# Altium schematic sheet CM_MODULE.SchDoc: Compute Module 4 (Part #2)
size A3
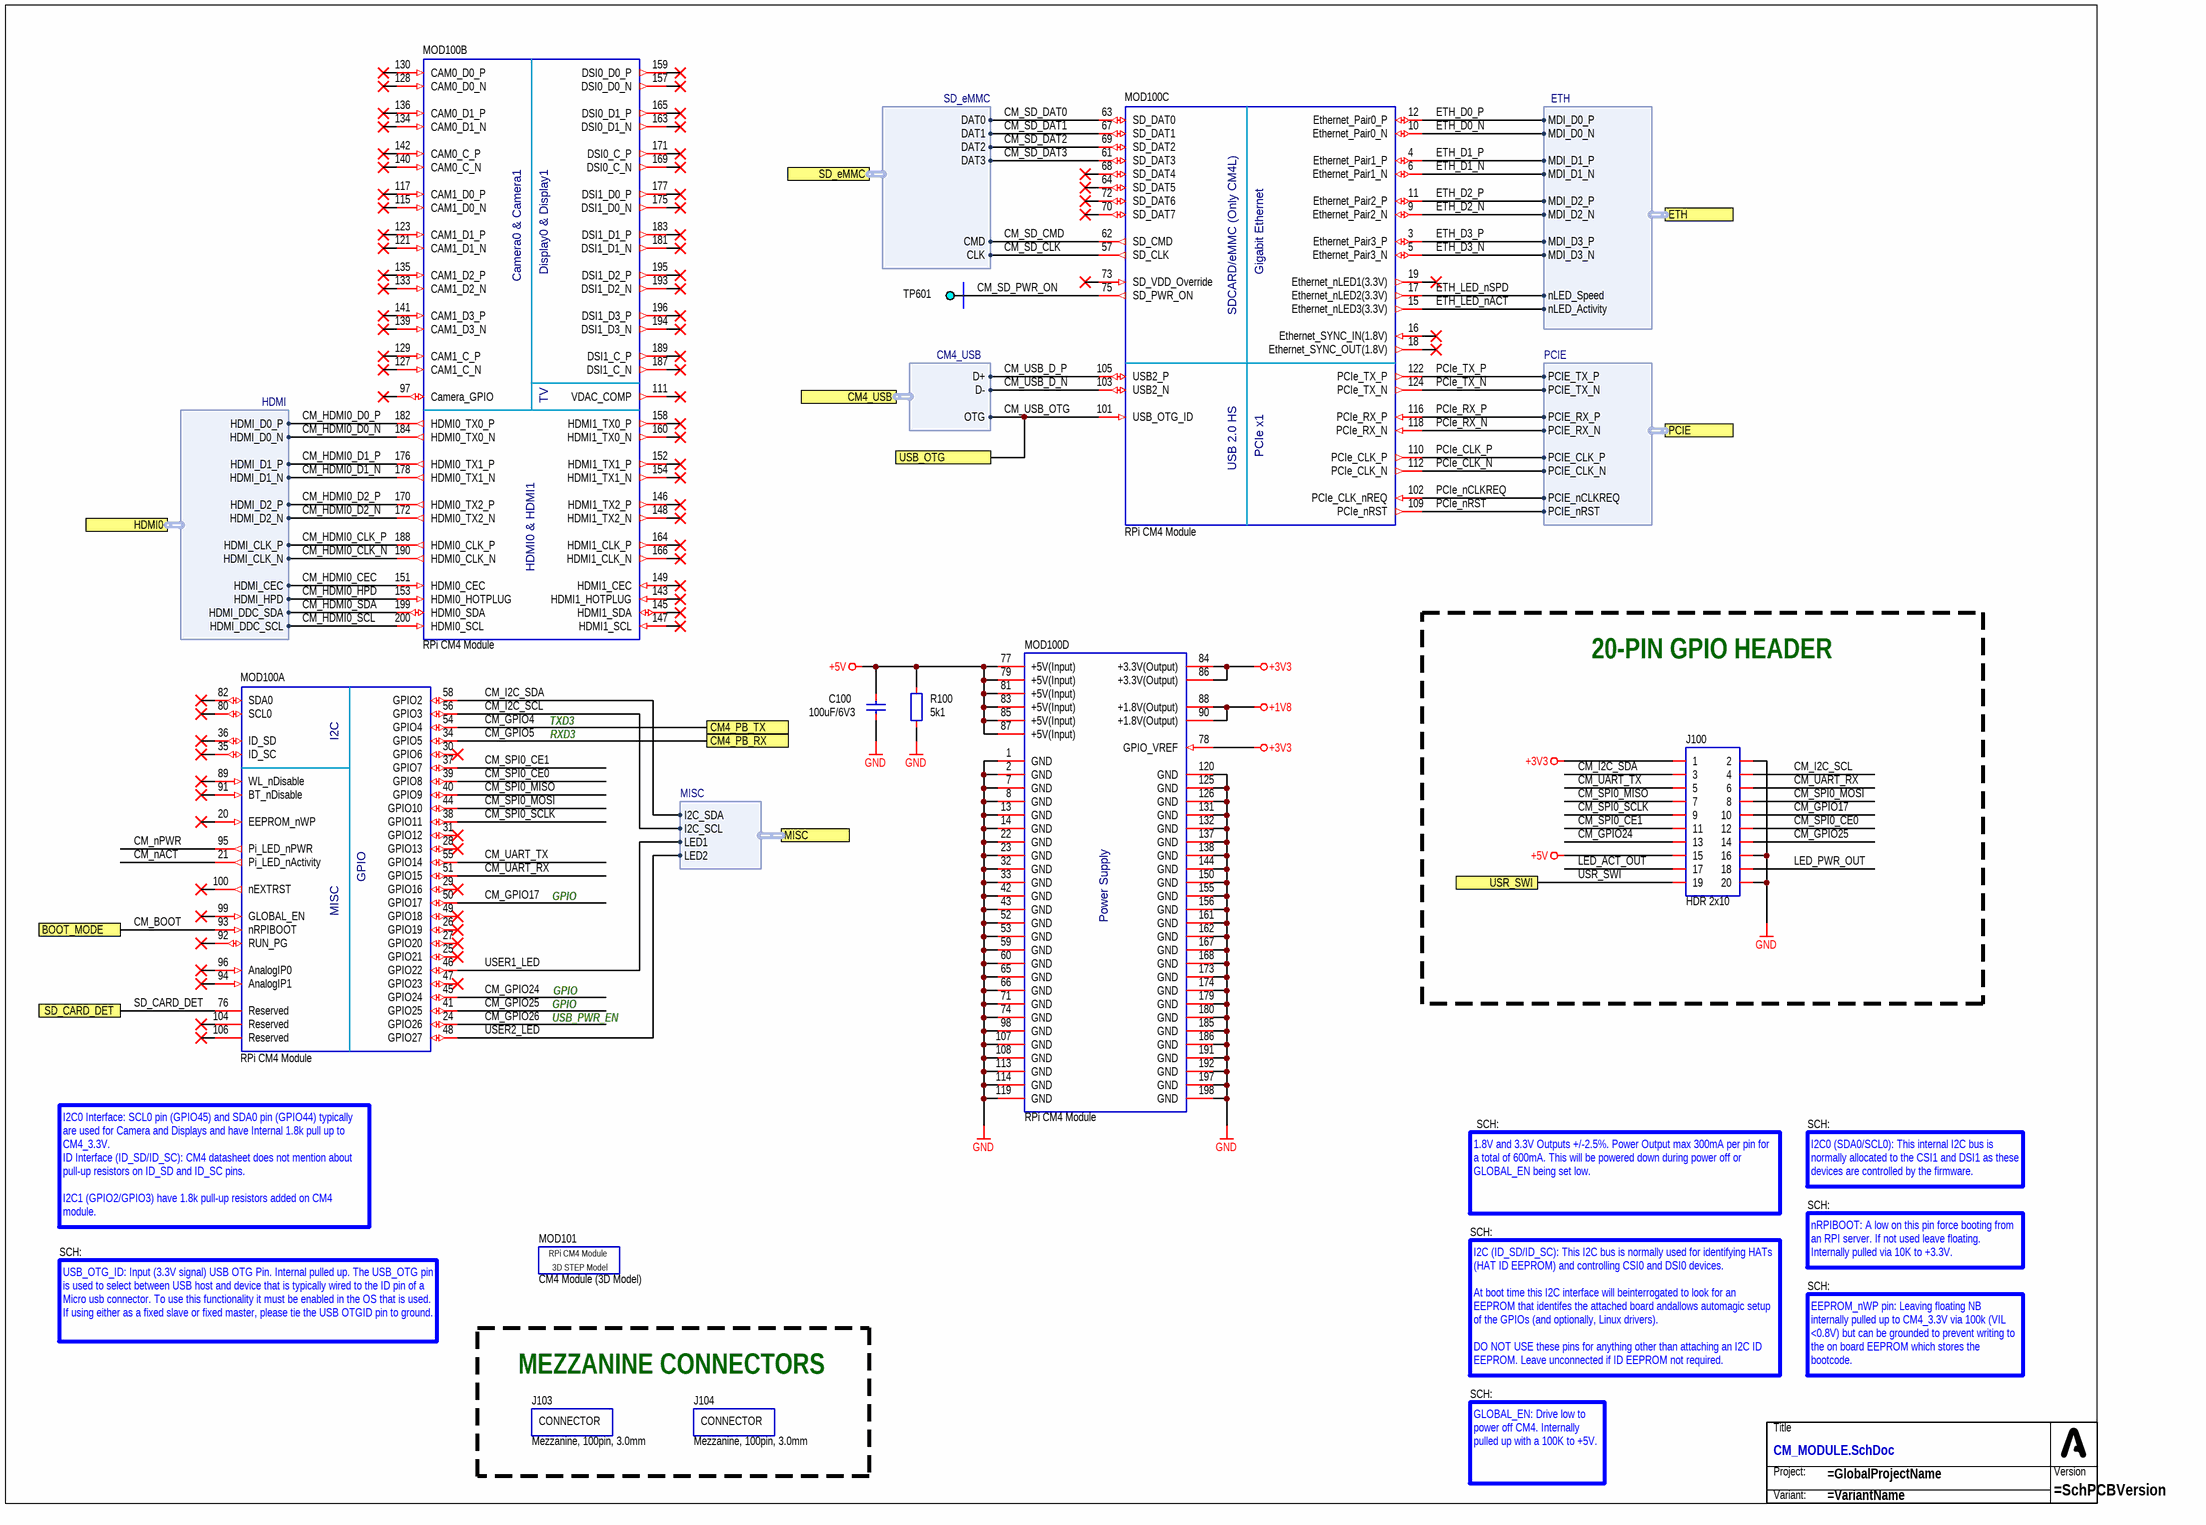
[diagram p0: CM_MODULE.SchDoc]

## Parts
C100  100uF/6V3  [CAP_1206_R]
J100  HDR 2x10  [CON_HDR_P254_2X10_STR]
J103  Mezzanine, 100pin, 3.0mm  [PCB_BLANK_COMP_SMD]
J104  Mezzanine, 100pin, 3.0mm  [PCB_BLANK_COMP_SMD]
MOD100  RPi CM4 Module  [MOD_RPI_CM4_SOCKET_P40_C300]  (parts A,B,C,D of 4)
MOD101  CM4 Module (3D Model)  [MOD_RPI_CM4_3D_C300_A1]  (no BOM)
R100  5k1  [RES_0603_R]
TB100  (no value)  (no BOM)
TP601  DEBUG  [PCB_TP_DBG_50]  (value not drawn)  (no BOM)

## Ports
BOOT_MODE, CM4_PB_RX, CM4_PB_TX, CM4_USB (harness CM4_USB), ETH (harness ETH), HDMI0 (harness HDMI), MISC (harness MISC), PCIE (harness PCIE), SD_CARD_DET, SD_eMMC (harness SD_eMMC), USB_OTG, USR_SWI

## Harnesses
SD_eMMC: DAT0, DAT1, DAT2, DAT3, CMD, CLK
CM4_USB: D+, D-, OTG
ETH: MDI_D0_P, MDI_D0_N, MDI_D1_P, MDI_D1_N, MDI_D2_P, MDI_D2_N, MDI_D3_P, MDI_D3_N, nLED_Speed, nLED_Activity
PCIE: PCIE_TX_P, PCIE_TX_N, PCIE_RX_P, PCIE_RX_N, PCIE_CLK_P, PCIE_CLK_N, PCIE_nCLKREQ, PCIE_nRST
HDMI: HDMI_D0_P, HDMI_D0_N, HDMI_D1_P, HDMI_D1_N, HDMI_CEC, HDMI_DDC_SDA, HDMI_D2_P, HDMI_D2_N, HDMI_CLK_P, HDMI_CLK_N, HDMI_DDC_SCL, HDMI_HPD
MISC: I2C_SDA, I2C_SCL, LED1, LED2

## Nets
+1V8: MOD100.88(+1.8V(Output)) MOD100.90(+1.8V(Output))
+3V3: J100.1 MOD100.78(GPIO_VREF) MOD100.84(+3.3V(Output)) MOD100.86(+3.3V(Output))
+5V: C100.2 J100.15 MOD100.77(+5V(Input)) MOD100.79(+5V(Input)) MOD100.81(+5V(Input)) MOD100.83(+5V(Input)) MOD100.85(+5V(Input)) MOD100.87(+5V(Input)) R100.1
GND: C100.1 J100.2 J100.16 J100.20 MOD100.1(GND) MOD100.2(GND) MOD100.7(GND) MOD100.8(GND) MOD100.13(GND) MOD100.14(GND) MOD100.22(GND) MOD100.23(GND) MOD100.32(GND) MOD100.33(GND) MOD100.42(GND) MOD100.43(GND) MOD100.52(GND) MOD100.53(GND) MOD100.59(GND) MOD100.60(GND) MOD100.65(GND) MOD100.66(GND) MOD100.71(GND) MOD100.74(GND) MOD100.98(GND) MOD100.107(GND) MOD100.108(GND) MOD100.113(GND) MOD100.114(GND) MOD100.119(GND) MOD100.120(GND) MOD100.125(GND) MOD100.126(GND) MOD100.131(GND) MOD100.132(GND) MOD100.137(GND) MOD100.138(GND) MOD100.144(GND) MOD100.150(GND) MOD100.155(GND) MOD100.156(GND) MOD100.161(GND) MOD100.162(GND) MOD100.167(GND) MOD100.168(GND) MOD100.173(GND) MOD100.174(GND) MOD100.179(GND) MOD100.180(GND) MOD100.185(GND) MOD100.186(GND) MOD100.191(GND) MOD100.192(GND) MOD100.197(GND) MOD100.198(GND) R100.2
CM_BOOT: MOD100.93(nRPIBOOT) ; port BOOT_MODE
CM_GPIO4: MOD100.54(GPIO4) ; port CM4_PB_TX
CM_GPIO5: MOD100.34(GPIO5) ; port CM4_PB_RX
CM_GPIO17: J100.10 MOD100.50(GPIO17)
CM_GPIO24: J100.13 MOD100.45(GPIO24)
CM_GPIO25: J100.14 MOD100.41(GPIO25)
CM_GPIO26: MOD100.24(GPIO26)
CM_HDMI0_CEC: MOD100.151(HDMI0_CEC) ; port HDMI0.HDMI_CEC
CM_HDMI0_CLK_N: MOD100.190(HDMI0_CLK_N) ; port HDMI0.HDMI_CLK_N
CM_HDMI0_CLK_P: MOD100.188(HDMI0_CLK_P) ; port HDMI0.HDMI_CLK_P
CM_HDMI0_D0_N: MOD100.184(HDMI0_TX0_N) ; port HDMI0.HDMI_D0_N
CM_HDMI0_D0_P: MOD100.182(HDMI0_TX0_P) ; port HDMI0.HDMI_D0_P
CM_HDMI0_D1_N: MOD100.178(HDMI0_TX1_N) ; port HDMI0.HDMI_D1_N
CM_HDMI0_D1_P: MOD100.176(HDMI0_TX1_P) ; port HDMI0.HDMI_D1_P
CM_HDMI0_D2_N: MOD100.172(HDMI0_TX2_N) ; port HDMI0.HDMI_D2_N
CM_HDMI0_D2_P: MOD100.170(HDMI0_TX2_P) ; port HDMI0.HDMI_D2_P
CM_HDMI0_HPD: MOD100.153(HDMI0_HOTPLUG) ; port HDMI0.HDMI_HPD
CM_HDMI0_SCL: MOD100.200(HDMI0_SCL) ; port HDMI0.HDMI_DDC_SCL
CM_HDMI0_SDA: MOD100.199(HDMI0_SDA) ; port HDMI0.HDMI_DDC_SDA
CM_I2C_SCL: J100.4 MOD100.56(GPIO3) ; port MISC.I2C_SCL
CM_I2C_SDA: J100.3 MOD100.58(GPIO2) ; port MISC.I2C_SDA
CM_nACT: MOD100.21(Pi_LED_nActivity)
CM_nPWR: MOD100.95(Pi_LED_nPWR)
CM_SD_CLK: MOD100.57(SD_CLK) ; port SD_eMMC.CLK
CM_SD_CMD: MOD100.62(SD_CMD) ; port SD_eMMC.CMD
CM_SD_DAT0: MOD100.63(SD_DAT0) ; port SD_eMMC.DAT0
CM_SD_DAT1: MOD100.67(SD_DAT1) ; port SD_eMMC.DAT1
CM_SD_DAT2: MOD100.69(SD_DAT2) ; port SD_eMMC.DAT2
CM_SD_DAT3: MOD100.61(SD_DAT3) ; port SD_eMMC.DAT3
CM_SD_PWR_ON: MOD100.75(SD_PWR_ON) TP601.1
CM_SPI0_CE0: J100.12 MOD100.39(GPIO8)
CM_SPI0_CE1: J100.11 MOD100.37(GPIO7)
CM_SPI0_MISO: J100.7 MOD100.40(GPIO9)
CM_SPI0_MOSI: J100.8 MOD100.44(GPIO10)
CM_SPI0_SCLK: J100.9 MOD100.38(GPIO11)
CM_UART_RX: J100.6 MOD100.51(GPIO15)
CM_UART_TX: J100.5 MOD100.55(GPIO14)
CM_USB_D_N: MOD100.103(USB2_N) ; port CM4_USB.D-
CM_USB_D_P: MOD100.105(USB2_P) ; port CM4_USB.D+
CM_USB_OTG: MOD100.101(USB_OTG_ID) ; port USB_OTG, port CM4_USB.OTG
ETH_D0_N: MOD100.10(Ethernet_Pair0_N) ; port ETH.MDI_D0_N
ETH_D0_P: MOD100.12(Ethernet_Pair0_P) ; port ETH.MDI_D0_P
ETH_D1_N: MOD100.6(Ethernet_Pair1_N) ; port ETH.MDI_D1_N
ETH_D1_P: MOD100.4(Ethernet_Pair1_P) ; port ETH.MDI_D1_P
ETH_D2_N: MOD100.9(Ethernet_Pair2_N) ; port ETH.MDI_D2_N
ETH_D2_P: MOD100.11(Ethernet_Pair2_P) ; port ETH.MDI_D2_P
ETH_D3_N: MOD100.5(Ethernet_Pair3_N) ; port ETH.MDI_D3_N
ETH_D3_P: MOD100.3(Ethernet_Pair3_P) ; port ETH.MDI_D3_P
ETH_LED_nACT: MOD100.15(Ethernet_nLED3(3.3V)) ; port ETH.nLED_Activity
ETH_LED_nSPD: MOD100.17(Ethernet_nLED2(3.3V)) ; port ETH.nLED_Speed
LED_ACT_OUT: J100.17
LED_PWR_OUT: J100.18
PCIe_CLK_N: MOD100.112(PCIe_CLK_N) ; port PCIE.PCIE_CLK_N
PCIe_CLK_P: MOD100.110(PCIe_CLK_P) ; port PCIE.PCIE_CLK_P
PCIe_nCLKREQ: MOD100.102(PCIe_CLK_nREQ) ; port PCIE.PCIE_nCLKREQ
PCIe_nRST: MOD100.109(PCIe_nRST) ; port PCIE.PCIE_nRST
PCIe_RX_N: MOD100.118(PCIe_RX_N) ; port PCIE.PCIE_RX_N
PCIe_RX_P: MOD100.116(PCIe_RX_P) ; port PCIE.PCIE_RX_P
PCIe_TX_N: MOD100.124(PCIe_TX_N) ; port PCIE.PCIE_TX_N
PCIe_TX_P: MOD100.122(PCIe_TX_P) ; port PCIE.PCIE_TX_P
SD_CARD_DET: MOD100.76(Reserved) ; port SD_CARD_DET
USER1_LED: MOD100.46(GPIO22) ; port MISC.LED1
USER2_LED: MOD100.48(GPIO27) ; port MISC.LED2
USR_SWI: J100.19 ; port USR_SWI

Not connected (* = marked no-connect by the designer): MOD100 16(Ethernet_SYNC_IN(1.8V))* 18(Ethernet_SYNC_OUT(1.8V))* 19(Ethernet_nLED1(3.3V))* 20(EEPROM_nWP)* 25(GPIO21)* 26(GPIO19)* 27(GPIO20)* 28(GPIO13)* 29(GPIO16)* 30(GPIO6)* 31(GPIO12)* 35(ID_SC)* 36(ID_SD)* 47(GPIO23)* 49(GPIO18)* 64(SD_DAT5)* 68(SD_DAT4)* 70(SD_DAT7)* 72(SD_DAT6)* 73(SD_VDD_Override)* 80(SCL0)* 82(SDA0)* 89(WL_nDisable)* 91(BT_nDisable)* 92(RUN_PG)* 94(AnalogIP1)* 96(AnalogIP0)* 97(Camera_GPIO)* 99(GLOBAL_EN)* 100(nEXTRST)* 104(Reserved)* 106(Reserved)* 111(VDAC_COMP)* 115(CAM1_D0_N)* 117(CAM1_D0_P)* 121(CAM1_D1_N)* 123(CAM1_D1_P)* 127(CAM1_C_N)* 128(CAM0_D0_N)* 129(CAM1_C_P)* 130(CAM0_D0_P)* 133(CAM1_D2_N)* 134(CAM0_D1_N)* 135(CAM1_D2_P)* 136(CAM0_D1_P)* 139(CAM1_D3_N)* 140(CAM0_C_N)* 141(CAM1_D3_P)* 142(CAM0_C_P)* 143(HDMI1_HOTPLUG)* 145(HDMI1_SDA)* 146(HDMI1_TX2_P)* 147(HDMI1_SCL)* 148(HDMI1_TX2_N)* 149(HDMI1_CEC)* 152(HDMI1_TX1_P)* 154(HDMI1_TX1_N)* 157(DSI0_D0_N)* 158(HDMI1_TX0_P)* 159(DSI0_D0_P)* 160(HDMI1_TX0_N)* 163(DSI0_D1_N)* 164(HDMI1_CLK_P)* 165(DSI0_D1_P)* 166(HDMI1_CLK_N)* 169(DSI0_C_N)* 171(DSI0_C_P)* 175(DSI1_D0_N)* 177(DSI1_D0_P)* 181(DSI1_D1_N)* 183(DSI1_D1_P)* 187(DSI1_C_N)* 189(DSI1_C_P)* 193(DSI1_D2_N)* 194(DSI1_D3_N)* 195(DSI1_D2_P)* 196(DSI1_D3_P)*

## Notes on the sheet
- TXD3
- 20-PIN GPIO HEADER
- RXD3
- GPIO
- USB_PWR_EN
- SCH:
- I2C0 (SDA0/SCL0): This internal I2C bus is normally allocated to the CSI1 and DSI1 as these devices are controlled by the firmware.
- I2C0 Interface: SCL0 pin (GPIO45) and SDA0 pin (GPIO44) typically are used for Camera and Displays and have Internal 1.8k pull up to CM4_3.3V.
  ID Interface (ID_SD/ID_SC): CM4 datasheet does not mention about pull-up resistors on ID_SD and ID_SC pins.
  I2C1 (GPIO2/GPIO3) have 1.8k pull-up resistors added on CM4 module.
- 1.8V and 3.3V Outputs +/-2.5%. Power Output max 300mA per pin for a total of 600mA. This will be powered down during power off or GLOBAL_EN being set low.
- nRPIBOOT: A low on this pin force booting from an RPI server. If not used leave floating. Internally pulled via 10K to +3.3V.
- USB_OTG_ID: Input (3.3V signal) USB OTG Pin. Internal pulled up. The USB_OTG pin is used to select between USB host and device that is typically wired to the ID pin of a Micro usb connector. To use this functionality it must be enabled in the OS that is used. If using either as a fixed slave or fixed master, please tie the USB OTGID pin to ground.
- MEZZANINE CONNECTORS
- (near TB100) I2C (ID_SD/ID_SC): This I2C bus is normally used for identifying HATs (HAT ID EEPROM) and controlling CSI0 and DSI0 devices.
  At boot time this I2C interface will beinterrogated to look for an EEPROM that identifes the attached board andallows automagic setup of the GPIOs (and optionally, Linux drivers).
  DO NOT USE these pins for anything other than attaching an I2C ID EEPROM. Leave unconnected if ID EEPROM not required.
- EEPROM_nWP pin: Leaving floating NB internally pulled up to CM4_3.3V via 100k (VIL <0.8V) but can be grounded to prevent writing to the on board EEPROM which stores the bootcode.
- GLOBAL_EN: Drive low to power off CM4. Internally pulled up with a 100K to +5V.
- (in symbol BOM_CON) CONNECTOR
- (in symbol MOD_CM4_3D_MODEL) RPi CM4 Module
- (in symbol MOD_RPI_CM4_VAR2, part A) I2C; GPIO; MISC
- (in symbol MOD_RPI_CM4_VAR2, part B) Display0 & Display1; Camera0 & Camera1; TV; HDMI0 & HDMI1
- (in symbol MOD_RPI_CM4_VAR2, part C) Gigabit Ethernet; SDCARD/eMMC (Only CM4L); PCIe x1; USB 2.0 HS
- (in symbol MOD_RPI_CM4_VAR2, part D) Power Supply
- (in symbol SCH_TITLE_BLOCK_SIMPLE_NODATE) Title; Project:; Version; Variant:

## Library data of the parts
C100 = CAP-0025: Capacitor; MLCC; 100uF 6V3; Manufacturer: Taiyo Yuden; MPN: JMK316ABJ107ML-T; Package (Case): 1206; Component Type: Capacitor; Component Subtype: MLCC; Value: 100uF/6V3; Mounting Type: SMD
J100 = CON_2X10_ROW: CONN THT / HEADER / PITCH 2,54mm / VERTICAL / (20 PIN) 2x10; MPN: B-2100S20P-B110; Manufacturer: Ckmtw(Shenzhen Cankemeng); Component Subtype: Pin Header; Component Type: Connector; Mounting Type: THT; Package (Case): THT; Value: HDR 2x10
J103 J104 = BOM_CON: Connector; DF40HC(3.0)-100DS-0.4V; Manufacturer: Hirose; Component Subtype: Microminiature; Package (Case): SMD; MPN: DF40HC(3.0)-100DS-0.4V; Value: Mezzanine, 100pin, 3.0mm; Component Type: Connector; Mounting Type: SMD
MOD100 = MOD_RPI_CM4_VAR2: PCB Module; RPi Compute Module 4;; Manufacturer: Raspberry Pi Foundation; Component Subtype: Raspberry Pi CM4; MPN: CM4 Module; Value: RPi CM4 Module; Component Type: PCB Module
MOD101 = MOD_CM4_3D_MODEL: PCB Module; RPi Compute Module 4; 3D model; Component Subtype: 3D STEP Model; Component Type: PCB Module; Value: CM4 Module (3D Model)
R100 = RES-0043: Resistor; Thick Film; 5k1; 1%; 100mW; 100PPM; 75V; Standard; SMD; 0603 (1608);; Manufacturer: UNI-ROYAL(Uniroyal Elec); MPN: 0603WAF5101T5E; Package (Case): 0603; Component Type: Resistor; Component Subtype: Thick Film; Value: 5k1; Mounting Type: SMD
TB100 = SCH_TITLE_BLOCK_SIMPLE_NODATE
TP601 = PCB_TP_DBG: PCB Marking; Test Point (Debug);; Value: DEBUG; Component Type: Testpoint